# EAGLE schematic GW-RFM-RS485-V30-003 (EAGLE 7.7.0)
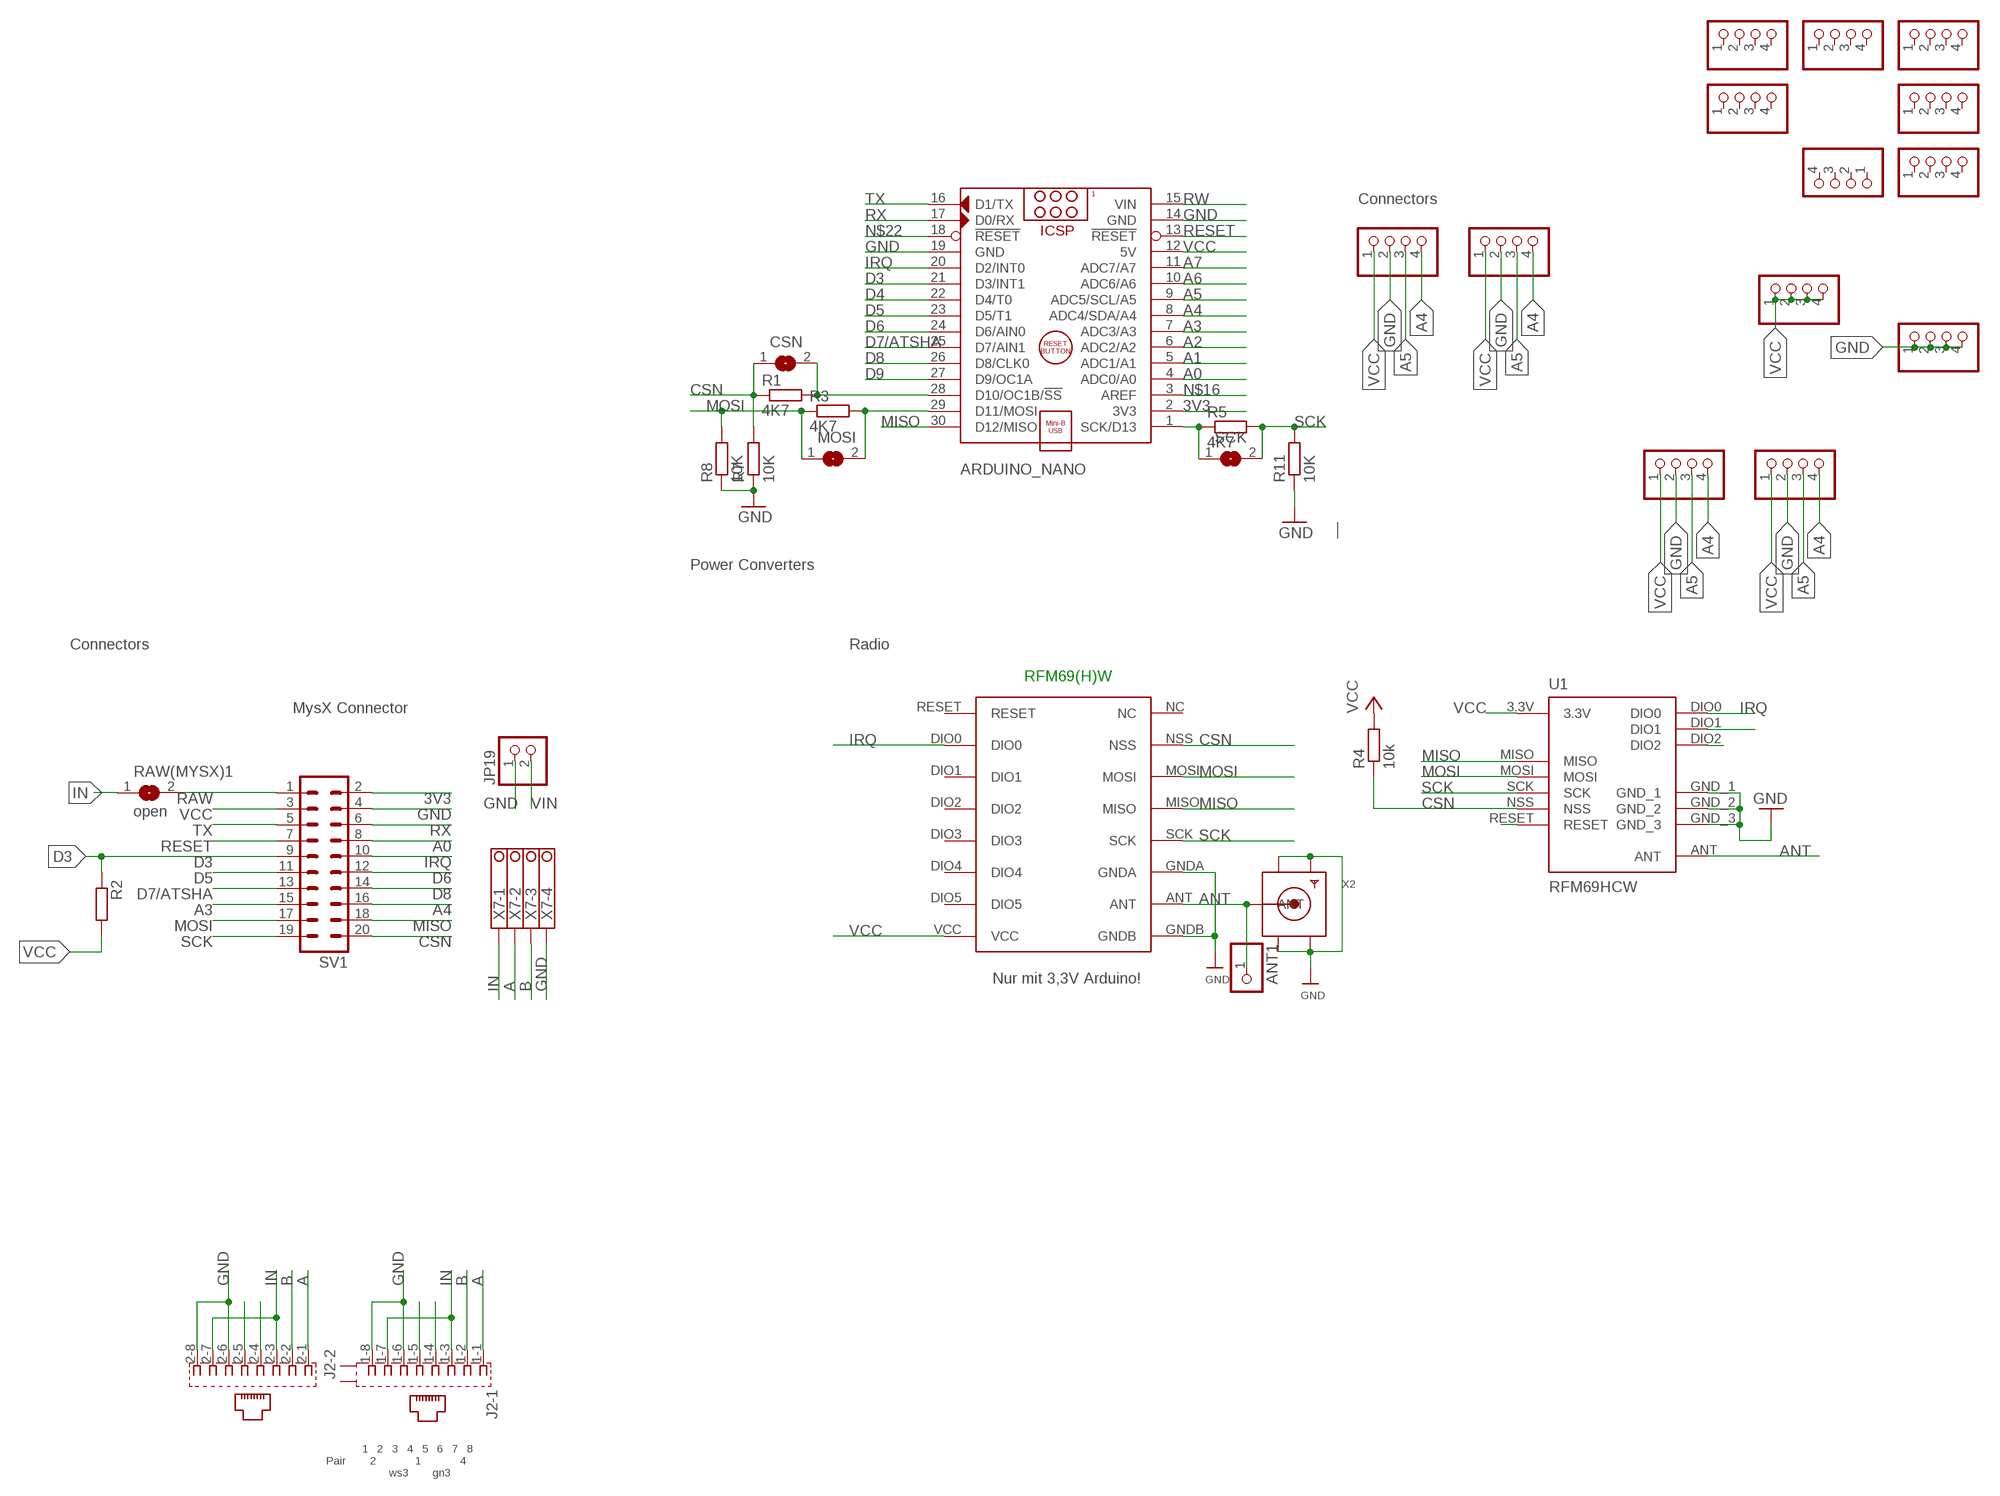
[diagram p0: schematic, sheet 1, part 1 of 2]
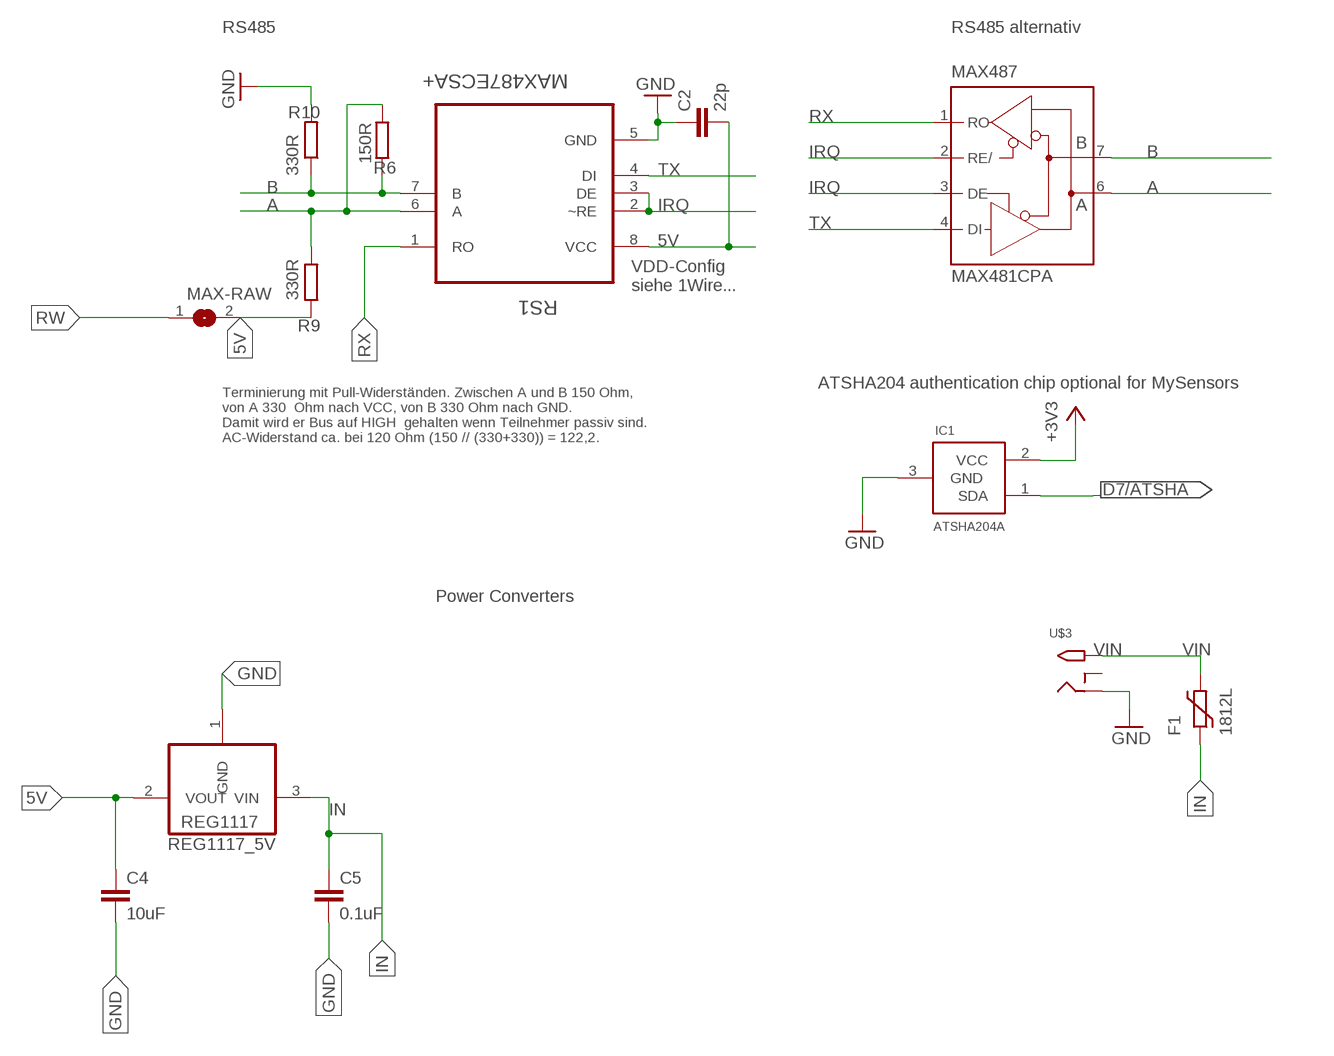
[diagram p1: schematic, sheet 1, part 2 of 2]

## Parts
ANT1  PINHD-1X1  [1X01]
ARDUINO_NANO  ARDUINO_NANO_OHNE-BOHR  [ARDUINO_NANO]
C2  22p  C-EUC0805  [C0805]
C4  10uF  C-EUC1210  [C1210]
C5  0.1uF  C-EUC1206  [C1206]
CSN  SJ  [SJ]
F1  1812L  [1812L]
IC1  ATSHA204A  [SOT23]
J2  557570-1  [557570-1]
JP1  PINHD-1X04_2.54-S  [1X04-S]
JP2  PINHD-1X04_2.54-S  [1X04-S]
JP3  PINHD-1X04_2.54-S  [1X04-S]
JP4  PINHD-1X04_2.54-S  [1X04-S]
JP5  PINHD-1X04_2.54-S  [1X04-S]
JP6  PINHD-1X04_2.54-S  [1X04-S]
JP7  PINHD-1X04_2.54-S  [1X04-S]
JP10  PINHD-1X04_2.54-S  [1X04-S]
JP11  PINHD-1X04_2.54-S  [1X04-S]
JP12  PINHD-1X04_2.54-S  [1X04-S]
JP15  PINHD-1X04_2.54-S  [1X04-S]
JP17  PINHD-1X04_2.54-S  [1X04-S]
JP18  PINHD-1X04_2.54-S  [1X04-S]
JP19  PINHD-1X2  [1X02]
MAX487  MAX481CPA  [DIL08]
MAX-RAW  SJ  [SJ]
MOSI  SJ  [SJ]
R1  4K7  R-EU_M0805  [M0805]
R2  R-EU_R0805  [R0805]
R3  4K7  R-EU_M0805  [M0805]
R4  10k  R-EU_M0805  [M0805]
R5  4K7  R-EU_M0805  [M0805]
R6  150R  R-EU_R0805  [R0805]
R7  10K  R-EU_M0805  [M0805]
R8  10K  R-EU_M0805  [M0805]
R9  330R  R-EU_R0805  [R0805]
R10  330R  R-EU_R0805  [R0805]
R11  10K  R-EU_M0805  [M0805]
RAW(MYSX)1  open  SJ  [SJ]
REG1117_5V  REG1117  [SOT223]
RFM69W  RFM69HW  [RFM]
RS1  MAX487ECSA+  [SOIC127P600X175-8N]
SCK  SJ  [SJ]
SV1  MA10-2  [MA10-2]
U1  RFM69HCW  [RFM69HCW-XXXS2]
U$3  2.1MMJACKTHM  [PJ-102A]
X2  SMACONNECTOR_EDGE  [SMA_EDGELAUNCH]
X7  1751264  [1751264]

## Nets
3V3: ARDUINO_NANO.2(3V3) SV1.2
5V: C2.2 C4.1 MAX-RAW.2 R9.1 REG1117_5V.2(VOUT) RS1.8(VCC)
A: J2.1-1 J2.2-1 MAX487.6(A) R6.1 R9.2 RS1.6(A) X7.2
A0: ARDUINO_NANO.4(ADC0/A0) SV1.8
A1: ARDUINO_NANO.5(ADC1/A1)
A2: ARDUINO_NANO.6(ADC2/A2)
A3: ARDUINO_NANO.7(ADC3/A3) SV1.15
A4: ARDUINO_NANO.8(ADC4/SDA/A4) JP6.4 JP10.4 JP17.4 JP18.4 SV1.16
A5: ARDUINO_NANO.9(ADC5/SCL/A5) JP6.3 JP10.3 JP17.3 JP18.3
A6: ARDUINO_NANO.10(ADC6/A6)
A7: ARDUINO_NANO.11(ADC7/A7)
ANT: ANT1.1 RFM69W.ANT U1.ANT X2.P(ANT)
B: J2.1-2 J2.2-2 MAX487.7(B) R6.2 R10.1 RS1.7(B) X7.3
CSN: CSN.1 R1.1 R4.1 R7.2 RFM69W.NSS SV1.20 U1.NSS
D3: ARDUINO_NANO.21(D3/INT1) R2.1 SV1.9
D4: ARDUINO_NANO.22(D4/T0)
D5: ARDUINO_NANO.23(D5/T1) SV1.11
D6: ARDUINO_NANO.24(D6/AIN0) SV1.12
D7/ATSHA: ARDUINO_NANO.25(D7/AIN1) IC1.1(SDA) SV1.13
D8: ARDUINO_NANO.26(D8/CLK0) SV1.14
D9: ARDUINO_NANO.27(D9/OC1A)
GND [Power]: ARDUINO_NANO.14(GND) ARDUINO_NANO.19(GND) C2.1 C4.2 C5.2 IC1.3(GND) J2.1-6 J2.1-8 J2.2-6 J2.2-8 JP1.1 JP1.2 JP1.3 JP1.4 JP6.2 JP10.2 JP17.2 JP18.2 JP19.1 R7.1 R8.1 R10.2 R11.1 REG1117_5V.1(GND) RFM69W.GNDA RFM69W.GNDB RS1.5(GND) SV1.4 U1.GND_1 U1.GND_2 U1.GND_3 U$3.RING X2.GND@1(GND4) X2.GND@2(GND3) X2.GND@3(GND2) X2.GND@4(GND1) X7.4
IN [Power]: C5.1 F1.P$1 J2.1-3 J2.1-7 J2.2-3 J2.2-7 RAW(MYSX)1.1 REG1117_5V.3(VIN) X7.1
IRQ: ARDUINO_NANO.20(D2/INT0) RFM69W.DIO0 RS1.2(~RE) RS1.3(DE) SV1.10 U1.DIO0
MISO: ARDUINO_NANO.30(D12/MISO) RFM69W.MISO SV1.18 U1.MISO
MOSI: MOSI.1 R3.1 R8.2 RFM69W.MOSI SV1.17 U1.MOSI
N$1: MAX487.2(RE/)
N$2: J2.1-4
N$3: J2.1-5
N$4: MAX487.3(DE)
N$5: ARDUINO_NANO.1(SCK/D13) R5.1 SCK.1
N$6: J2.2-4
N$7: J2.2-5
N$8: ARDUINO_NANO.28(D10/OC1B/!SS) CSN.2 R1.2
N$9: ARDUINO_NANO.29(D11/MOSI) MOSI.2 R3.2
N$10: MAX487.1(RO)
N$11: MAX487.4(DI)
N$12: U1.DIO2
N$13: U1.RESET
N$15: U1.DIO1
N$16: ARDUINO_NANO.3(AREF)
N$22: ARDUINO_NANO.18(!RESET)
RAW: RAW(MYSX)1.2 SV1.1
RESET: ARDUINO_NANO.13(!RESET) SV1.7
RW: ARDUINO_NANO.15(VIN) MAX-RAW.1
RX: ARDUINO_NANO.17(D0/RX) RS1.1(RO) SV1.6
SCK: R5.2 R11.2 RFM69W.SCK SCK.2 SV1.19 U1.SCK
TX: ARDUINO_NANO.16(D1/TX) RS1.4(DI) SV1.5
VCC [Power]: ARDUINO_NANO.12(5V) IC1.2(VCC) JP3.1 JP3.2 JP3.3 JP3.4 JP6.1 JP10.1 JP17.1 JP18.1 R2.2 R4.2 RFM69W.VCC SV1.3 U1.3.3V ; supply symbol labelled +3V3
VIN [Power]: F1.P$2 JP19.2 U$3.TIP
Unconnected: J2.G1(-1:S2) J2.G3(-1:S1) JP2.1 JP2.2 JP2.3 JP2.4 JP4.1 JP4.2 JP4.3 JP4.4 JP5.1 JP5.2 JP5.3 JP5.4 JP7.1 JP7.2 JP7.3 JP7.4 JP11.1 JP11.2 JP11.3 JP11.4 JP12.1 JP12.2 JP12.3 JP12.4 JP15.1 JP15.2 JP15.3 JP15.4 RFM69W.DIO1 RFM69W.DIO2 RFM69W.DIO3 RFM69W.DIO4 RFM69W.DIO5 RFM69W.NC RFM69W.RESET U$3.RING_SW

## Notes on the sheet
- Connectors
- Power Converters
- Connectors | Radio | RS485 | RS485 alternativ
- RFM69(H)W
- MysX Connector
- VDD-Config
  siehe 1Wire...
- ATSHA204 authentication chip optional for MySensors
- Nur mit 3,3V Arduino!
- Terminierung mit Pull-Widerständen. Zwischen A und B 150 Ohm,
  von A 330  Ohm nach VCC, von B 330 Ohm nach GND. 
  Damit wird er Bus auf HIGH  gehalten wenn Teilnehmer passiv sind.
  AC-Widerstand ca. bei 120 Ohm (150 // (330+330)) = 122,2.
- Power Converters
- 1   2   3   4   5   6   7   8
  Pair        2             1             4
                       ws3        gn3

## Power pins joined to a net without a drawn wire
GND: MAX487.5(GND)
VCC: MAX487.8(VCC)

## Library data of the parts
ANT1 = pinhead:PINHD-1X1: PIN HEADER
ARDUINO_NANO = ArduinoNanoV30:ARDUINO_NANO_OHNE-BOHR: Arduino Nano V3.0 Module Overview: The Arduino Nano is a small, complete, and breadboard-friendly board based on the ATmega328 (Arduino Nano 3.x) or ATmega168 (Arduino Nano 2.x). It has more or less the same functionality of the Arduino Duemilanove, but in a different package. It lacks only a DC power jack, and works with a Mini-B USB cable instead of a standard one. The Nano was designed and is being produced by Gravitech <http://www.gravitech.us/arna30wiatp.html>. General specifications: Item Value Microcontroller Atmel ATmega168 or ATmega328 Operating Voltage (logic level) 5 V Input Voltage (recommended) 7-12 V Input Voltage (limits) 6-20 V Digital I/O Pins 14 (of which 6 provide PWM output) Analog Input Pins 8 DC Current per I/O Pin 40 mA Flash Memory 16 KB (ATmega168) or 32 KB (ATmega328) of which 2 KB used by bootloader SRAM 1 KB (ATmega168) or 2 KB (ATmega328) EEPROM 512 bytes (ATmega168) or 1 KB (ATmega328) Clock Speed 16 MHz Dimensions (Inches) 0.73" x 1.70" Dimensions (mm) 18mm x 45mm Overall height About 9 mm (not including pins) Weigth 5 g Power: The Arduino Nano can be powered via the Mini-B USB connection, 6-20V unregulated external power supply (pin 30), or 5V regulated external power supply (pin 27). The power source is automatically selected to the highest voltage source. Memory: The ATmega168 has 16 KB of flash memory for storing code (of which 2 KB is used for the bootloader); the ATmega328 has 32 KB, (also with 2 KB used for the bootloader). The ATmega168 has 1 KB of SRAM and 512 bytes of EEPROM (which can be read and written with the EEPROM library); the ATmega328 has 2 KB of SRAM and 1 KB of EEPROM. Input and Output: Each of the 14 digital pins on the Nano can be used as an input or output, using pinMode(), digitalWrite(), and digitalRead() functions. They operate at 5 volts. Each pin can provide or receive a maximum of 40 mA and has an internal pull-up resistor (disconnected by default) of 20-50 kOhms. In addition, some pins have specialized functions. Visit Arduino - ArduinoBoardNano <https://www.arduino.cc/en/Main/ArduinoBoardNano>
C2 = rcl:C-EU: CAPACITOR, European symbol; SPICEPREFIX: C
C4 C5 = rcl@1:C-EU: CAPACITOR, European symbol; SPICEPREFIX: C
CSN MAX-RAW MOSI SCK = jumper@1:SJ: SMD solder JUMPER
F1 = ptc-littlefuse:1812L
IC1 = Sensor:ATSHA204A
J2 = con-amp:557570-1: AMP connector
JP1-JP7 JP10-JP12 JP15 JP17 JP18 = pinhead-2:PINHD-1X04: PIN HEADER
JP19 = pinhead:PINHD-1X2: PIN HEADER
MAX487 = maxim-4:MAX481CPA: RS485 TRANSEIVER
R1-R11 = rcl:R-EU_: RESISTOR, European symbol
RAW(MYSX)1 = jumper:SJ: SMD solder JUMPER
REG1117_5V = burr-brown:REG1117: 800mA and 1A Low Dropout (LDO) Positive Regulator 1.8V, 2.5V, 2.85V, 3.3V, 5V, and Adj; MPN: REG1117; OC_FARNELL: 1097566; OC_NEWARK: 14P6981
RFM69W = hoperf:RFM69HW
RS1 = Maxim_By_element14_Batch_1:MAX487ECSA+: Low-Power, Slew-Rate-Limited RS-485/RS-422 Transceivers; MPN: MAX487ECSA+; OC_FARNELL: 9724532; OC_NEWARK: 68K4803; PACKAGE: SOIC-8; SUPPLIER: Maxim
SV1 = con-lstb:MA10-2: PIN HEADER; OC_FARNELL: unknown; OC_NEWARK: unknown
U1 = doug:RFM69H
U$3 = adafruit:2.1MMJACK: 2.1mm x 5.5mm THM DC jack with internal switch. Digikey part #PJ-102A, 4UCON part #05537 2.1mm x 5.5mm SMT DC jack with internal switch. Digikey part #PJ-002A-SMT, 4UCON part #03267 By microbuilder.eu & adafruit.com
X2 = adafruit:SMACONNECTOR: SMA Connector 90° DIP SMA Connector, 50 Ohm (4UConnector: 07259)
X7 = con-phoenix-350:1751264: MKDS 1/ 4-3,5 Printklemme Nennstrom: 10 A Bemessungsspannung: 160 V Raster: 3,5 mm Polzahl: 4 Montageart: Löten Anschlussart: Schraubanschluss Anschlussrichtung vom Leiter zur Platine: 0° Source: http://eshop.phoenixcontact.com .. 1751264.pdf; MPN: 1751264; OC_FARNELL: unknown; OC_NEWARK: 10R0934

## Net classes
0 default: width 0.305 mm
1 Power: width 0.508 mm